# Altium schematic sheet obc-v2_MCU-PinOut.SchDoc
size 420 x 297 mm; SheetNumber: 21; SheetTotal: 21
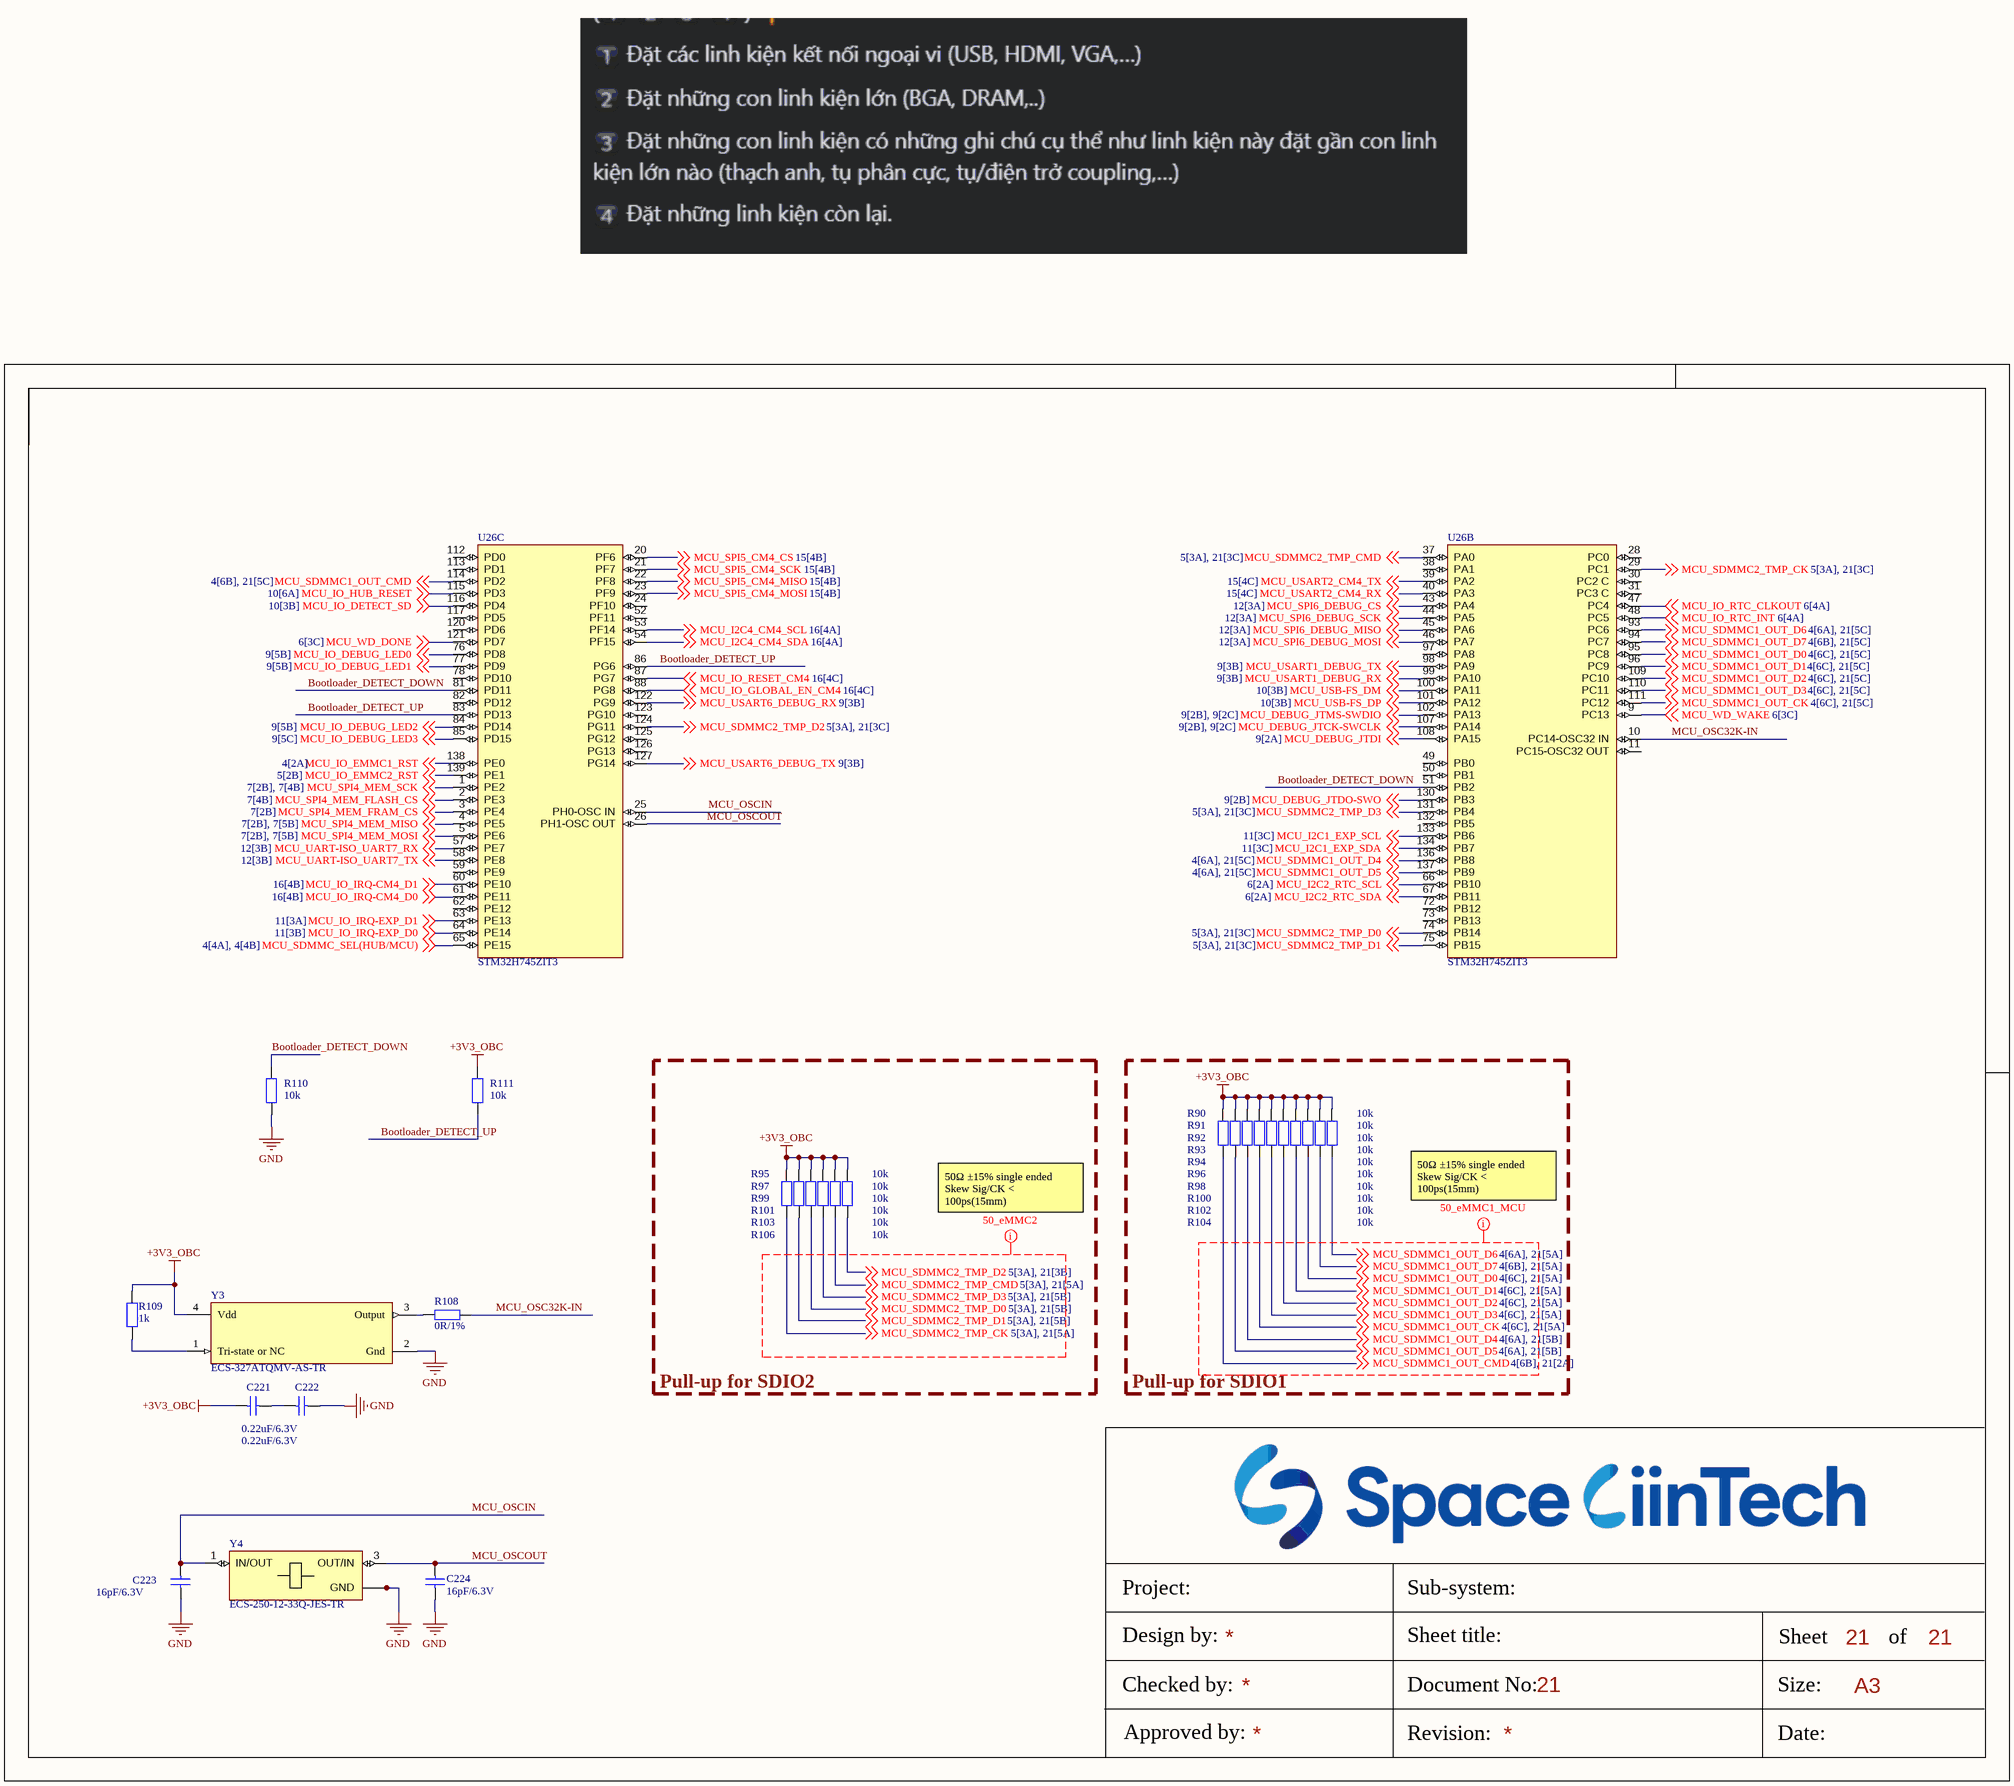
[diagram p0: obc-v2_MCU-PinOut.SchDoc]

## Parts
C221  0.22uF/6.3V  [CAP_C_1005X60]
C222  0.22uF/6.3V  [CAP_C_1005X60]
C223  16pF/6.3V  [CAP_C_1005X60]
C224  16pF/6.3V  [CAP_C_1005X60]
R90  10k  [RES_C_1608X60]
R91  10k  [RES_C_1608X60]
R92  10k  [RES_C_1608X60]
R93  10k  [RES_C_1608X60]
R94  10k  [RES_C_1608X60]
R95  10k  [RES_C_1608X60]
R96  10k  [RES_C_1608X60]
R97  10k  [RES_C_1608X60]
R98  10k  [RES_C_1608X60]
R99  10k  [RES_C_1608X60]
R100  10k  [RES_C_1608X60]
R101  10k  [RES_C_1608X60]
R102  10k  [RES_C_1608X60]
R103  10k  [RES_C_1608X60]
R104  10k  [RES_C_1608X60]
R106  10k  [RES_C_1608X60]
R108  0R/1%  [RES_C_1608X60]
R109  1k  [RES_C_1608X60]
R110  10k  [RES_C_1608X60]
R111  10k  [RES_C_1608X60]
U26  STM32H745ZIT3  [FP-LQFP144-1A-MFG]  (parts B,C of 3)
Y3  ECS-327ATQMV-AS-TR  [FP-327ATQMV-MFG]
Y4  ECS-250-12-33Q-JES-TR  [XTAL_ECS-250-12-33Q-JES-TR]

## Blocks framed on the sheet
Pull-up for SDIO2: R95 R97 R99 R101 R103 R106
Pull-up for SDIO1: R90-R94 R96 R98 R100 R102 R104

## Nets
+3V3_OBC: C221.1 R90.2 R91.2 R92.2 R93.2 R94.2 R95.2 R96.2 R97.2 R98.2 R99.2 R100.2 R101.2 R102.2 R103.2 R104.2 R106.2 R109.1 R111.2 Y3.4(Vdd)
GND: C222.2 C223.1 C224.1 R110.1 Y3.2(Gnd) Y4.2(GND) Y4.4(GND)
Bootloader_DETECT_DOWN: R110.2 U26.51(PB2) U26.81(PD11)
Bootloader_DETECT_UP: R111.1 U26.83(PD13) U26.86(PG6)
MCU_DEBUG_JTCK-SWCLK: U26.107(PA14) ; off-sheet MCU_DEBUG_JTCK-SWCLK
MCU_DEBUG_JTDI: U26.108(PA15) ; off-sheet MCU_DEBUG_JTDI
MCU_DEBUG_JTDO-SWO: U26.130(PB3) ; off-sheet MCU_DEBUG_JTDO-SWO
MCU_DEBUG_JTMS-SWDIO: U26.102(PA13) ; off-sheet MCU_DEBUG_JTMS-SWDIO
MCU_I2C1_EXP_SCL: U26.133(PB6) ; off-sheet MCU_I2C1_EXP_SCL
MCU_I2C1_EXP_SDA: U26.134(PB7) ; off-sheet MCU_I2C1_EXP_SDA
MCU_I2C2_RTC_SCL: U26.66(PB10) ; off-sheet MCU_I2C2_RTC_SCL
MCU_I2C2_RTC_SDA: U26.67(PB11) ; off-sheet MCU_I2C2_RTC_SDA
MCU_I2C4_CM4_SCL: U26.53(PF14) ; off-sheet MCU_I2C4_CM4_SCL
MCU_I2C4_CM4_SDA: U26.54(PF15) ; off-sheet MCU_I2C4_CM4_SDA
MCU_IO_DEBUG_LED0: U26.76(PD8) ; off-sheet MCU_IO_DEBUG_LED0
MCU_IO_DEBUG_LED1: U26.77(PD9) ; off-sheet MCU_IO_DEBUG_LED1
MCU_IO_DEBUG_LED2: U26.84(PD14) ; off-sheet MCU_IO_DEBUG_LED2
MCU_IO_DEBUG_LED3: U26.85(PD15) ; off-sheet MCU_IO_DEBUG_LED3
MCU_IO_DETECT_SD: U26.116(PD4) ; off-sheet MCU_IO_DETECT_SD
MCU_IO_EMMC1_RST: U26.138(PE0) ; off-sheet MCU_IO_EMMC1_RST
MCU_IO_EMMC2_RST: U26.139(PE1) ; off-sheet MCU_IO_EMMC2_RST
MCU_IO_GLOBAL_EN_CM4: U26.88(PG8) ; off-sheet MCU_IO_GLOBAL_EN_CM4
MCU_IO_HUB_RESET: U26.115(PD3) ; off-sheet MCU_IO_HUB_RESET
MCU_IO_IRQ-CM4_D0: U26.61(PE11) ; off-sheet MCU_IO_IRQ-CM4_D0
MCU_IO_IRQ-CM4_D1: U26.60(PE10) ; off-sheet MCU_IO_IRQ-CM4_D1
MCU_IO_IRQ-EXP_D0: U26.64(PE14) ; off-sheet MCU_IO_IRQ-EXP_D0
MCU_IO_IRQ-EXP_D1: U26.63(PE13) ; off-sheet MCU_IO_IRQ-EXP_D1
MCU_IO_RESET_CM4: U26.87(PG7) ; off-sheet MCU_IO_RESET_CM4
MCU_IO_RTC_CLKOUT: U26.47(PC4) ; off-sheet MCU_IO_RTC_CLKOUT
MCU_IO_RTC_INT: U26.48(PC5) ; off-sheet MCU_IO_RTC_INT
MCU_OSC32K-IN: R108.1 U26.10(PC14-OSC32_IN)
MCU_OSCIN: C223.2 U26.25(PH0-OSC_IN) Y4.1(IN/OUT)
MCU_OSCOUT: C224.2 U26.26(PH1-OSC_OUT) Y4.3(OUT/IN)
MCU_SDMMC1_OUT_CK: R93.1 U26.111(PC12) ; off-sheet MCU_SDMMC1_OUT_CK
MCU_SDMMC1_OUT_CMD: R90.1 U26.114(PD2) ; off-sheet MCU_SDMMC1_OUT_CMD
MCU_SDMMC1_OUT_D0: R100.1 U26.95(PC8) ; off-sheet MCU_SDMMC1_OUT_D0
MCU_SDMMC1_OUT_D1: R98.1 U26.96(PC9) ; off-sheet MCU_SDMMC1_OUT_D1
MCU_SDMMC1_OUT_D2: R96.1 U26.109(PC10) ; off-sheet MCU_SDMMC1_OUT_D2
MCU_SDMMC1_OUT_D3: R94.1 U26.110(PC11) ; off-sheet MCU_SDMMC1_OUT_D3
MCU_SDMMC1_OUT_D4: R92.1 U26.136(PB8) ; off-sheet MCU_SDMMC1_OUT_D4
MCU_SDMMC1_OUT_D5: R91.1 U26.137(PB9) ; off-sheet MCU_SDMMC1_OUT_D5
MCU_SDMMC1_OUT_D6: R104.1 U26.93(PC6) ; off-sheet MCU_SDMMC1_OUT_D6
MCU_SDMMC1_OUT_D7: R102.1 U26.94(PC7) ; off-sheet MCU_SDMMC1_OUT_D7
MCU_SDMMC2_TMP_CK: R95.1 U26.29(PC1) ; off-sheet MCU_SDMMC2_TMP_CK
MCU_SDMMC2_TMP_CMD: R103.1 U26.37(PA0) ; off-sheet MCU_SDMMC2_TMP_CMD
MCU_SDMMC2_TMP_D0: R99.1 U26.74(PB14) ; off-sheet MCU_SDMMC2_TMP_D0
MCU_SDMMC2_TMP_D1: R97.1 U26.75(PB15) ; off-sheet MCU_SDMMC2_TMP_D1
MCU_SDMMC2_TMP_D2: R106.1 U26.124(PG11) ; off-sheet MCU_SDMMC2_TMP_D2
MCU_SDMMC2_TMP_D3: R101.1 U26.131(PB4) ; off-sheet MCU_SDMMC2_TMP_D3
MCU_SDMMC_SEL(HUB/MCU): U26.65(PE15) ; off-sheet MCU_SDMMC_SEL(HUB/MCU)
MCU_SPI4_MEM_FLASH_CS: U26.2(PE3) ; off-sheet MCU_SPI4_MEM_FLASH_CS
MCU_SPI4_MEM_FRAM_CS: U26.3(PE4) ; off-sheet MCU_SPI4_MEM_FRAM_CS
MCU_SPI4_MEM_MISO: U26.4(PE5) ; off-sheet MCU_SPI4_MEM_MISO
MCU_SPI4_MEM_MOSI: U26.5(PE6) ; off-sheet MCU_SPI4_MEM_MOSI
MCU_SPI4_MEM_SCK: U26.1(PE2) ; off-sheet MCU_SPI4_MEM_SCK
MCU_SPI5_CM4_CS: U26.20(PF6) ; off-sheet MCU_SPI5_CM4_CS
MCU_SPI5_CM4_MISO: U26.22(PF8) ; off-sheet MCU_SPI5_CM4_MISO
MCU_SPI5_CM4_MOSI: U26.23(PF9) ; off-sheet MCU_SPI5_CM4_MOSI
MCU_SPI5_CM4_SCK: U26.21(PF7) ; off-sheet MCU_SPI5_CM4_SCK
MCU_SPI6_DEBUG_CS: U26.43(PA4) ; off-sheet MCU_SPI6_DEBUG_CS
MCU_SPI6_DEBUG_MISO: U26.45(PA6) ; off-sheet MCU_SPI6_DEBUG_MISO
MCU_SPI6_DEBUG_MOSI: U26.46(PA7) ; off-sheet MCU_SPI6_DEBUG_MOSI
MCU_SPI6_DEBUG_SCK: U26.44(PA5) ; off-sheet MCU_SPI6_DEBUG_SCK
MCU_UART-ISO_UART7_RX: U26.57(PE7) ; off-sheet MCU_UART-ISO_UART7_RX
MCU_UART-ISO_UART7_TX: U26.58(PE8) ; off-sheet MCU_UART-ISO_UART7_TX
MCU_USART1_DEBUG_RX: U26.99(PA10) ; off-sheet MCU_USART1_DEBUG_RX
MCU_USART1_DEBUG_TX: U26.98(PA9) ; off-sheet MCU_USART1_DEBUG_TX
MCU_USART2_CM4_RX: U26.40(PA3) ; off-sheet MCU_USART2_CM4_RX
MCU_USART2_CM4_TX: U26.39(PA2) ; off-sheet MCU_USART2_CM4_TX
MCU_USART6_DEBUG_RX: U26.122(PG9) ; off-sheet MCU_USART6_DEBUG_RX
MCU_USART6_DEBUG_TX: U26.127(PG14) ; off-sheet MCU_USART6_DEBUG_TX
MCU_USB-FS_DM: U26.100(PA11) ; off-sheet MCU_USB-FS_DM
MCU_USB-FS_DP: U26.101(PA12) ; off-sheet MCU_USB-FS_DP
MCU_WD_DONE: U26.121(PD7) ; off-sheet MCU_WD_DONE
MCU_WD_WAKE: U26.9(PC13) ; off-sheet MCU_WD_WAKE
NetC221_2: C221.2 C222.1
NetR108_2: R108.2 Y3.3(Output)
NetR109_2: R109.2 Y3.1(Tri-state_or_NC)

Not connected (* = marked no-connect by the designer): U26 11(PC15-OSC32_OUT) 24(PF10) 28(PC0) 30(PC2_C) 31(PC3_C) 38(PA1) 49(PB0) 50(PB1) 52(PF11) 59(PE9) 62(PE12) 72(PB12) 73(PB13) 78(PD10) 82(PD12) 97(PA8) 112(PD0) 113(PD1) 117(PD5) 120(PD6) 123(PG10) 125(PG12) 126(PG13) 132(PB5)

## Layout directives
net class 50_eMMC1_MCU: MCU_SDMMC1_OUT_CK, MCU_SDMMC1_OUT_CMD, MCU_SDMMC1_OUT_D0, MCU_SDMMC1_OUT_D1, MCU_SDMMC1_OUT_D2, MCU_SDMMC1_OUT_D3, MCU_SDMMC1_OUT_D4, MCU_SDMMC1_OUT_D5, MCU_SDMMC1_OUT_D6, MCU_SDMMC1_OUT_D7
net class 50_eMMC2: MCU_SDMMC2_TMP_CK, MCU_SDMMC2_TMP_CMD, MCU_SDMMC2_TMP_D0, MCU_SDMMC2_TMP_D1, MCU_SDMMC2_TMP_D2, MCU_SDMMC2_TMP_D3

## Notes on the sheet
- 50Ω ±15% single ended
  Skew Sig/CK < 100ps(15mm)
  Max Length 100mm
- Project:
- Sub-system:
- Design by:
- Sheet title:
- Sheet
- A3
- of
- Checked by:
- Approved by:
- Revision:
- Document No:
- Size:
- Date:

## Library data of the parts
C221-C224 = Tu 0402 33nF 10V: CAPC; Chung_Loai: Dán; Don_Vi: Con; So_Chan: 2; Ten_Linh_Kien: Tụ 0402 33nF X7R 10V GRM155R71A333KA01D; Ma_Hang: MH007853; Kieu_Chan: *
R90-R104 R106 R110 R111 = Tro 0603 1% 10k: RES 4.7K OHM 1% 1/10W 0603, P/N: ERJ-U03F4701V; Chung_Loai: Dán; Don_Vi: Con; So_Chan: 2; Ten_Linh_Kien: Trở 0603 1% 10k; Ma_Hang: MH006333; Kieu_Chan: *
R108 R109 = Tro 0603 1% 10k: RES; Chung_Loai: Dán; Don_Vi: Con; So_Chan: 2; Ten_Linh_Kien: Trở 0603 1% 10k; Ma_Hang: MH006333; Kieu_Chan: *
U26 = CMP-12105-000054-1: HIGH-PERFORMANCE AND DSP WITH DP; Manufacturer Part Number: STM32H745ZIT6; Manufacturer: STMicroelectronics; Number Of Timers/Counters: 20; Min Supply Voltage: 1.62V; Frequency: 480MHz; Number Of I2C Channels: 4; Memory Type: FLASH; Number Of I/Os: 97; Number Of Pwm Channels: 42; Number Of Usb Channels: 2; Ram Size: 1MBytes; Memory Size: 2MBytes; Data Bus Width: 32bits; Number Of Adc Channels: 23; Number Of Ethernet Channels: 1; Number Of Uart Channels: 9; Interface: I2C,SPI,UART,USART,CAN,USB,LIN,IrDA,Ethernet,I2S,Other; Number Of A/D Converters: 3; Max Junction Temp: +125°C; Max Supply Voltage: 3.6V; Core Architecture: ARM Cortex-M4, Cortex-M7; Number Of Spi Channels: 6; Standoff Height: 0.05mm; Ambient Temperature Range Low: -40°C; Lead Free: Yes; Automotive: No; Height: 1.6mm; Device Class L1: Integrated Circuits (ICs); Ambient Temperature Range High: +85°C; RoHS: TRUE; Temperature Range High: +125°C; Temperature: -40°C to +125°C; Category: IC; Device Class L2: Embedded Processors and Controllers; Number Of Cores: 2; Temperature Range Low: -40°C; Octopart: https://octopart.com/stm32h745zit6-stmicroelectronics-100293939; Digikey Description: HIGH-PERFORMANCE AND DSP WITH DP; Package: LQFP144-1A; Device Class L3: Microcontrollers; ComponentLink2URL: https://www.st.com/resource/en/datasheet/stm32h745zi.pdf; ComponentLink2Description: Datasheet
Y3 = CMP-40224-000027-1: XTAL OSC XO 32.7680KHZ CMOS SMD; RoHS Compliant: Yes
Y4 = ECS-250-12-33Q-JES-TR: 25 MHz Â±20ppm Crystal 12pF 40 Ohms 4-SMD, No Lead; MF: ECS Inc.; Value: *; Purchase-URL: https://pricing.snapeda.com/search/part/ECS-250-12-33Q-JES-TR/?ref=eda; Package: ECS-33B ECS Inc.; Availability: In Stock; SnapEDA_Link: https://www.snapeda.com/parts/ECS-250-12-33Q-JES-TR/ECS+Inc./view-part/?ref=snap; MP: ECS-250-12-33Q-JES-TR; Check_prices: https://www.snapeda.com/parts/ECS-250-12-33Q-JES-TR/ECS+Inc./view-part/?ref=eda; Price: None